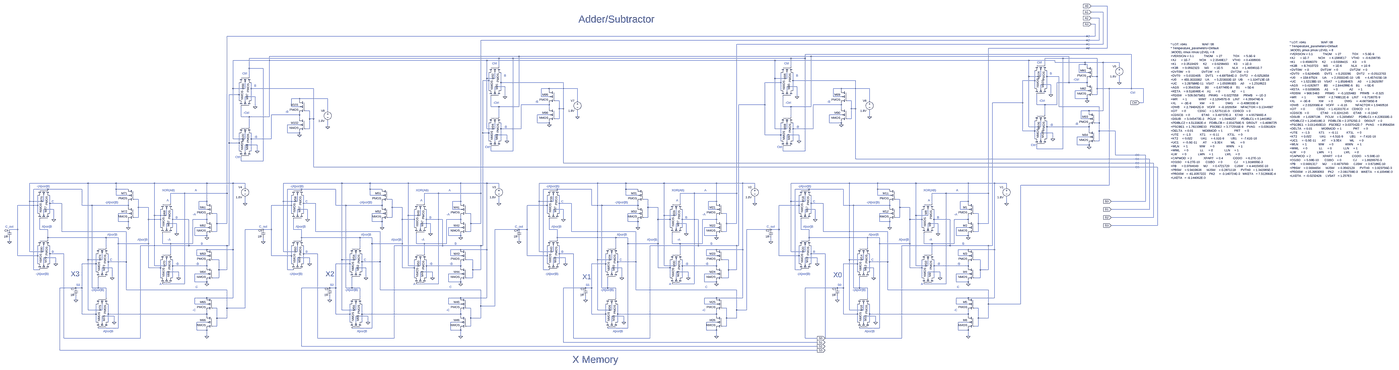
[diagram p0: schematic Adder_Subtractor.asc, whole sheet]
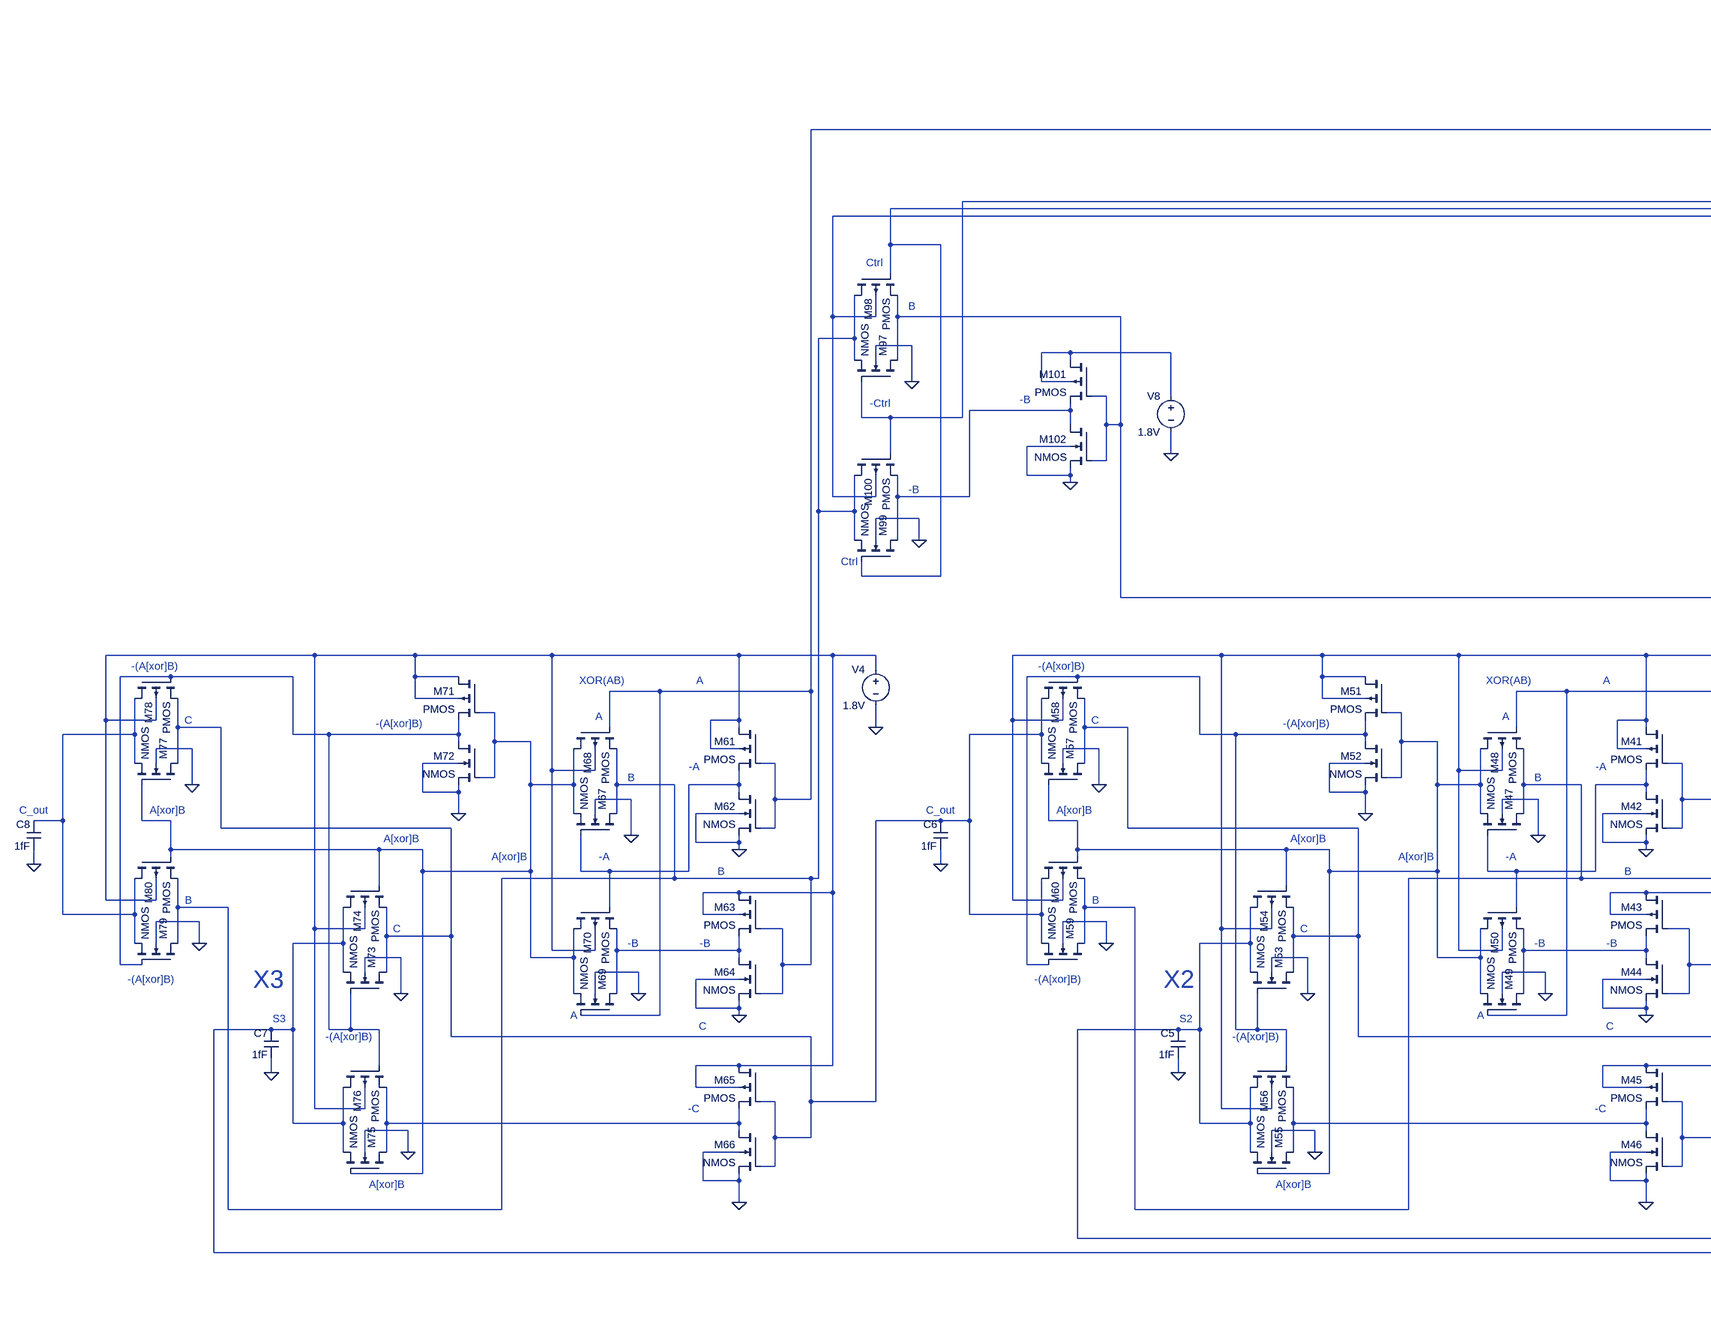
[diagram p1: schematic Adder_Subtractor.asc, part, row 1 of 1, column 1 of 3]
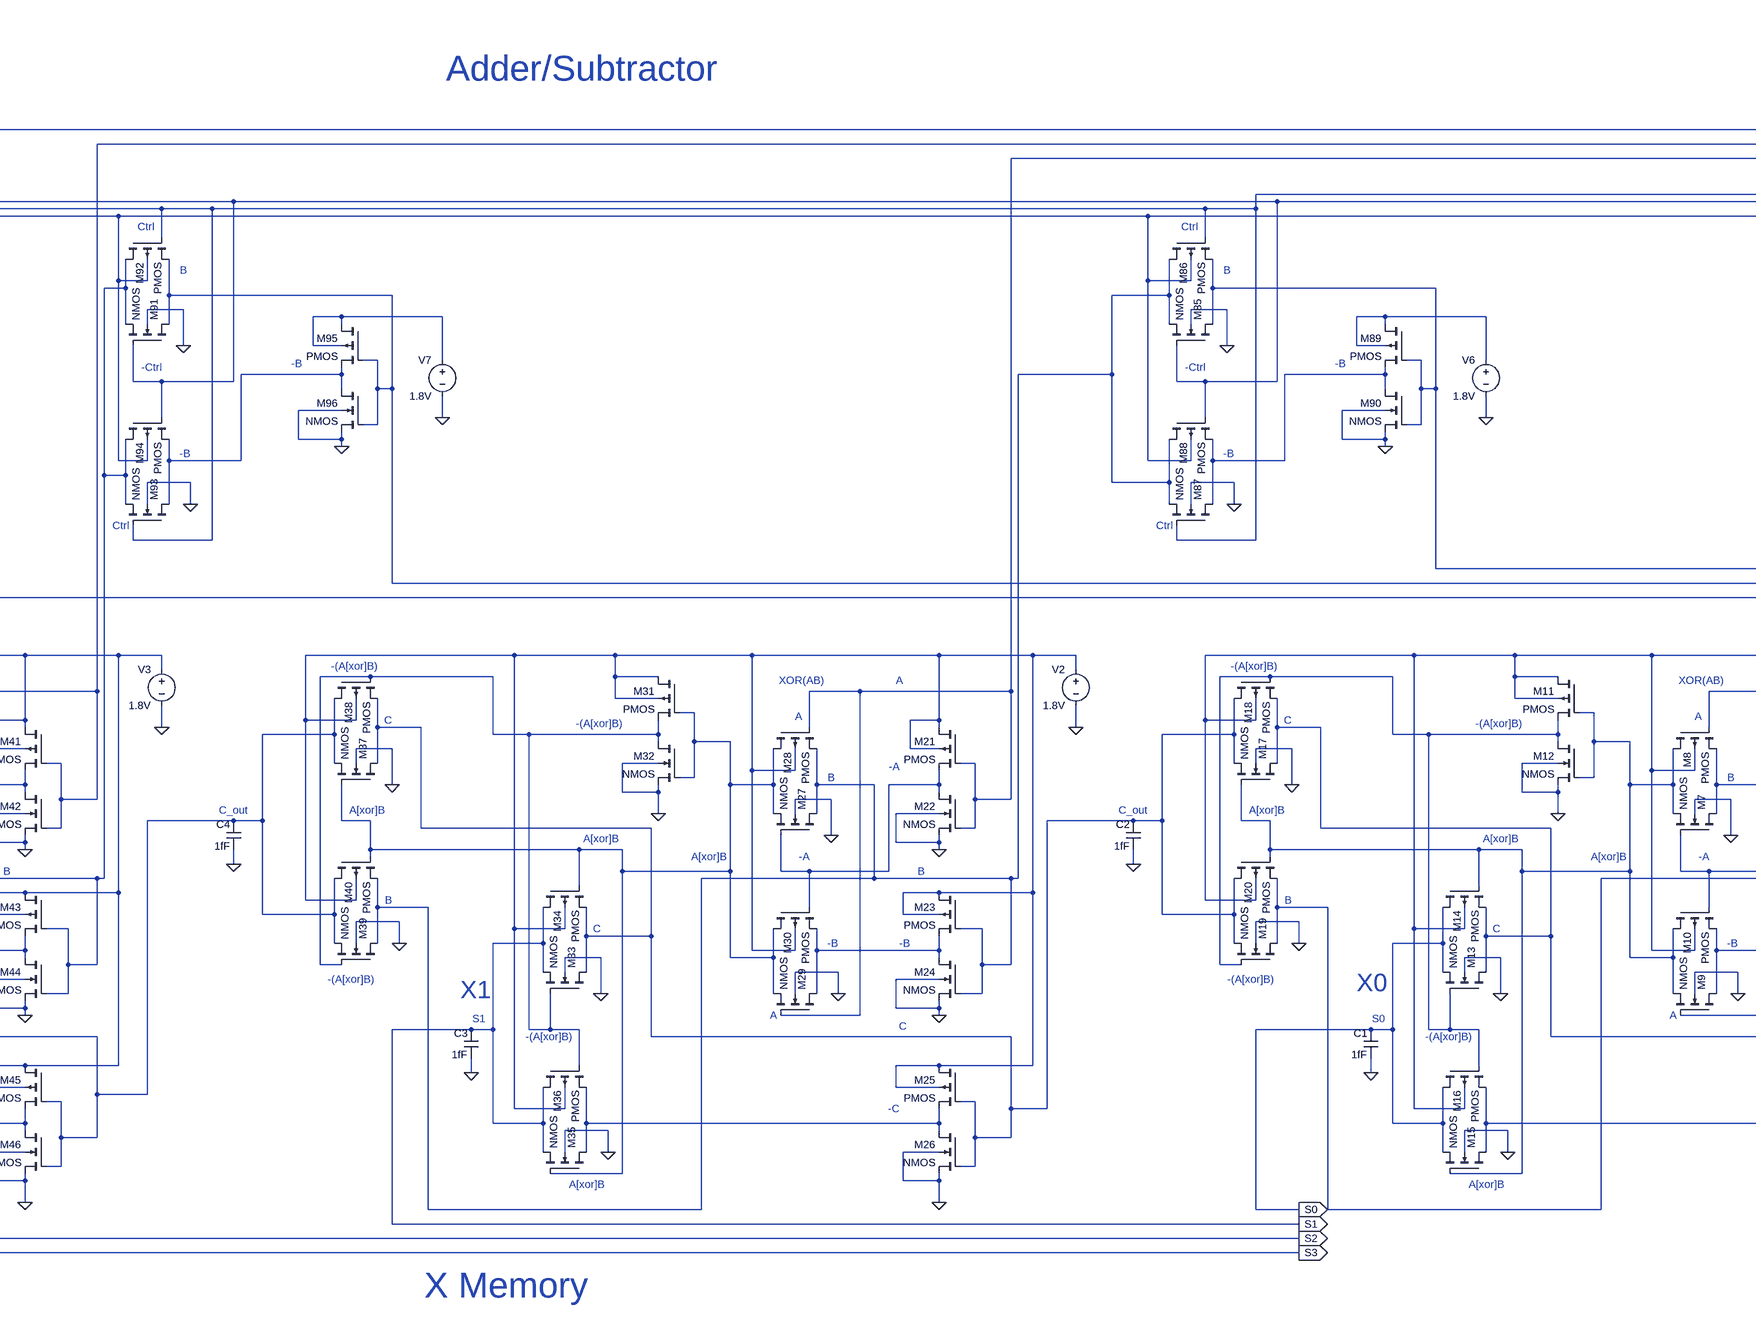
[diagram p2: schematic Adder_Subtractor.asc, part, row 1 of 1, column 2 of 3]
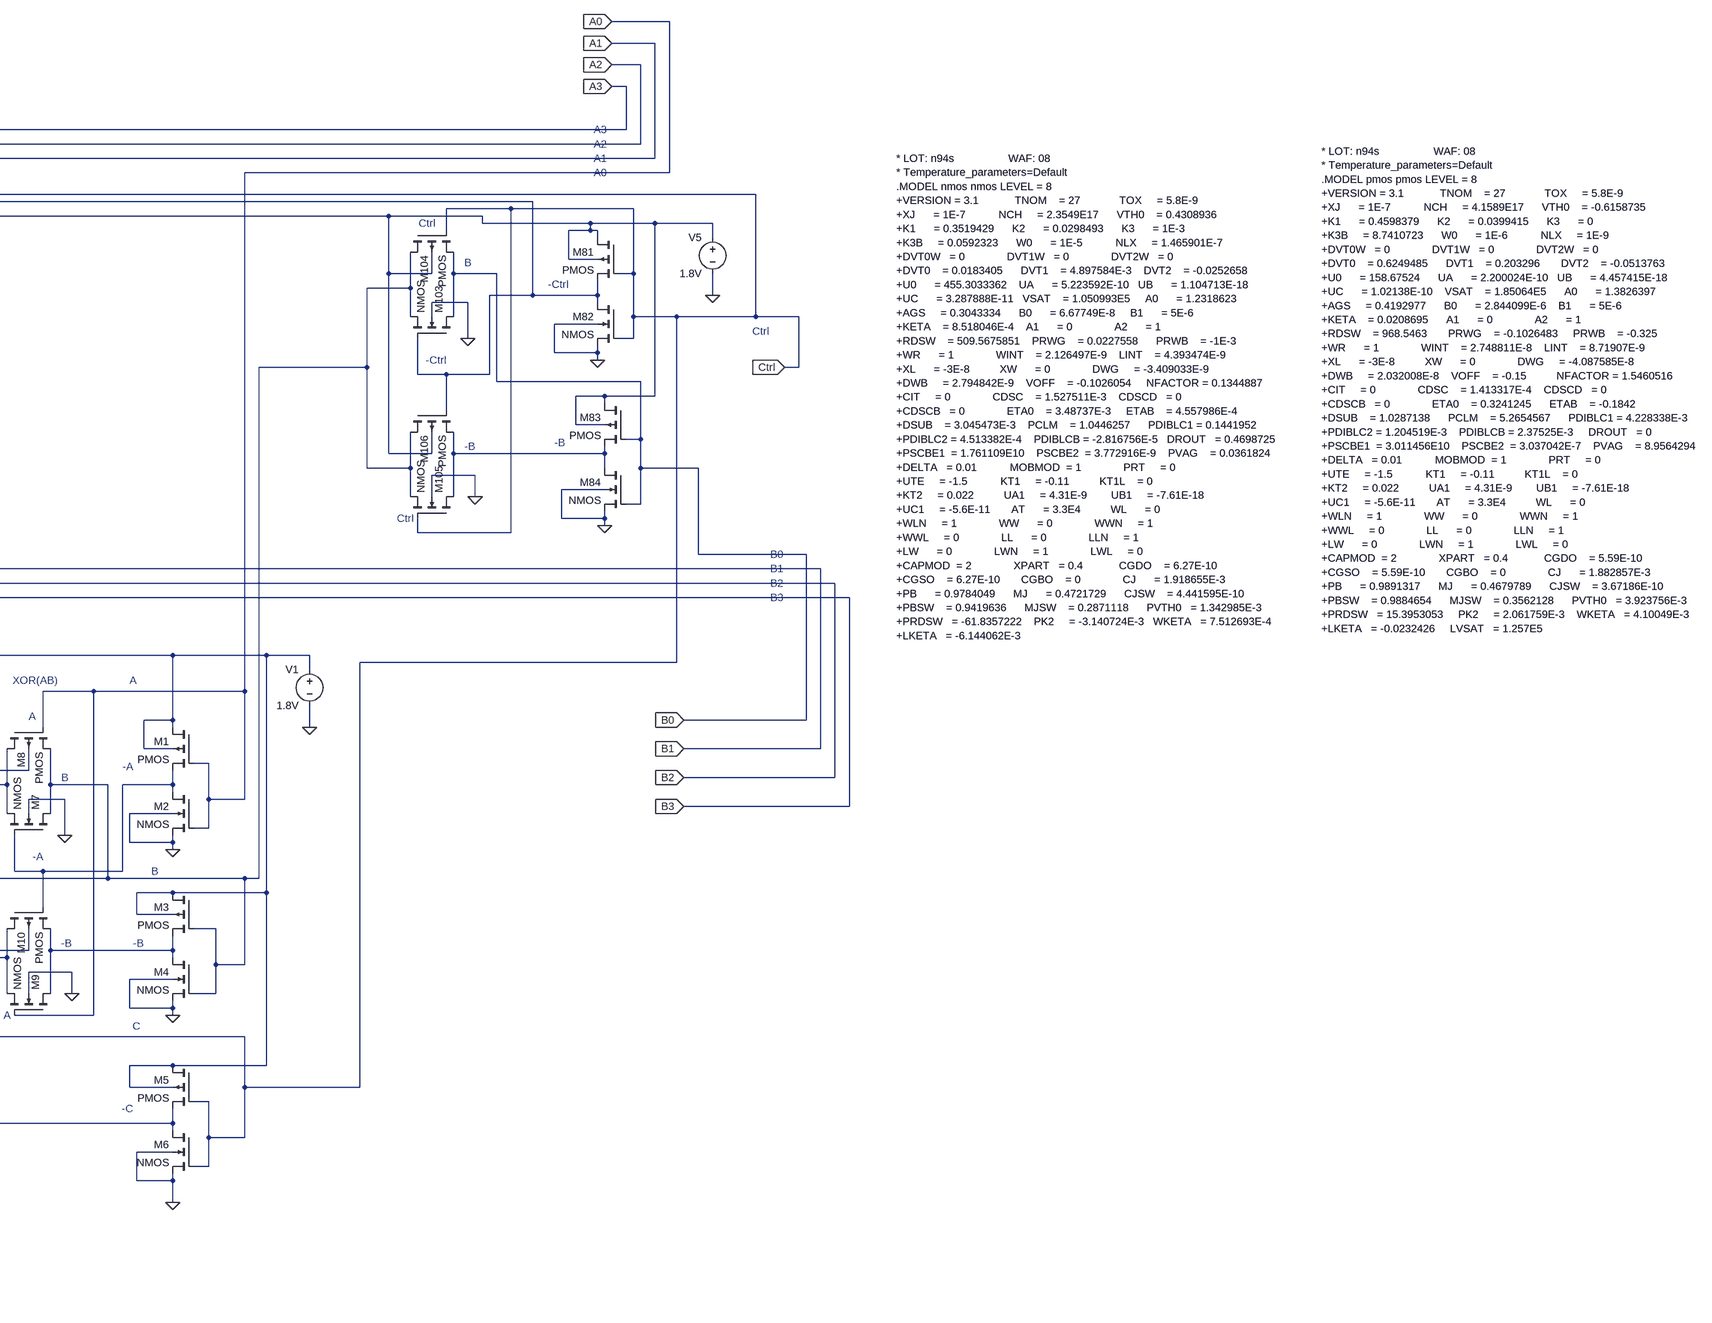
[diagram p3: schematic Adder_Subtractor.asc, part, row 1 of 1, column 3 of 3]
* Adder_Subtractor.asc
V1 N017 0 1.8V
M1 N017 A0 N033 N017 PMOS l=180n w=880n
M2 N033 A0 0 0 NMOS l=180n w=440n
M3 N017 N004 N037 N017 PMOS l=180n w=880n
M4 N037 N004 0 0 NMOS l=180n w=440n
M5 N017 Ctrl N041 N017 PMOS l=180n w=880n
M6 N041 Ctrl 0 0 NMOS l=180n w=440n
M7 N004 N033 N025 0 NMOS l=180n w=440n
M8 N025 A0 N004 N017 PMOS l=180n w=440n
M9 N037 A0 N025 0 NMOS l=180n w=440n
M10 N025 N033 N037 N017 PMOS l=180n w=440n
M11 N017 N025 N021 N017 PMOS l=180n w=880n
M12 N021 N025 0 0 NMOS l=180n w=440n
M13 Ctrl N021 S0 0 NMOS l=180n w=440n
M14 S0 N025 Ctrl N017 PMOS l=180n w=440n
M15 N041 N025 S0 0 NMOS l=180n w=440n
M16 S0 N021 N041 N017 PMOS l=180n w=440n
C1 S0 0 1fF
M17 Ctrl N025 N028 0 NMOS l=180n w=440n
M18 N028 N021 Ctrl N017 PMOS l=180n w=440n
M19 N004 N021 N028 0 NMOS l=180n w=440n
M20 N028 N025 N004 N017 PMOS l=180n w=440n
C2 N028 0 1fF
V2 N016 0 1.8V
M21 N016 A1 N032 N016 PMOS l=180n w=880n
M22 N032 A1 0 0 NMOS l=180n w=440n
M23 N016 N005 N036 N016 PMOS l=180n w=880n
M24 N036 N005 0 0 NMOS l=180n w=440n
M25 N016 N028 N040 N016 PMOS l=180n w=880n
M26 N040 N028 0 0 NMOS l=180n w=440n
M27 N005 N032 N024 0 NMOS l=180n w=440n
M28 N024 A1 N005 N016 PMOS l=180n w=440n
M29 N036 A1 N024 0 NMOS l=180n w=440n
M30 N024 N032 N036 N016 PMOS l=180n w=440n
M31 N016 N024 N020 N016 PMOS l=180n w=880n
M32 N020 N024 0 0 NMOS l=180n w=440n
M33 N028 N020 S1 0 NMOS l=180n w=440n
M34 S1 N024 N028 N016 PMOS l=180n w=440n
M35 N040 N024 S1 0 NMOS l=180n w=440n
M36 S1 N020 N040 N016 PMOS l=180n w=440n
C3 S1 0 1fF
M37 N028 N024 N027 0 NMOS l=180n w=440n
M38 N027 N020 N028 N016 PMOS l=180n w=440n
M39 N005 N020 N027 0 NMOS l=180n w=440n
M40 N027 N024 N005 N016 PMOS l=180n w=440n
C4 N027 0 1fF
V3 N015 0 1.8V
M41 N015 A2 N031 N015 PMOS l=180n w=880n
M42 N031 A2 0 0 NMOS l=180n w=440n
M43 N015 N003 N035 N015 PMOS l=180n w=880n
M44 N035 N003 0 0 NMOS l=180n w=440n
M45 N015 N027 N039 N015 PMOS l=180n w=880n
M46 N039 N027 0 0 NMOS l=180n w=440n
M47 N003 N031 N023 0 NMOS l=180n w=440n
M48 N023 A2 N003 N015 PMOS l=180n w=440n
M49 N035 A2 N023 0 NMOS l=180n w=440n
M50 N023 N031 N035 N015 PMOS l=180n w=440n
M51 N015 N023 N019 N015 PMOS l=180n w=880n
M52 N019 N023 0 0 NMOS l=180n w=440n
M53 N027 N019 S2 0 NMOS l=180n w=440n
M54 S2 N023 N027 N015 PMOS l=180n w=440n
M55 N039 N023 S2 0 NMOS l=180n w=440n
M56 S2 N019 N039 N015 PMOS l=180n w=440n
C5 S2 0 1fF
M57 N027 N023 N026 0 NMOS l=180n w=440n
M58 N026 N019 N027 N015 PMOS l=180n w=440n
M59 N003 N019 N026 0 NMOS l=180n w=440n
M60 N026 N023 N003 N015 PMOS l=180n w=440n
C6 N026 0 1fF
V4 N014 0 1.8V
M61 N014 A3 N030 N014 PMOS l=180n w=880n
M62 N030 A3 0 0 NMOS l=180n w=440n
M63 N014 N008 N034 N014 PMOS l=180n w=880n
M64 N034 N008 0 0 NMOS l=180n w=440n
M65 N014 N026 N038 N014 PMOS l=180n w=880n
M66 N038 N026 0 0 NMOS l=180n w=440n
M67 N008 N030 N022 0 NMOS l=180n w=440n
M68 N022 A3 N008 N014 PMOS l=180n w=440n
M69 N034 A3 N022 0 NMOS l=180n w=440n
M70 N022 N030 N034 N014 PMOS l=180n w=440n
M71 N014 N022 N018 N014 PMOS l=180n w=880n
M72 N018 N022 0 0 NMOS l=180n w=440n
M73 N026 N018 S3 0 NMOS l=180n w=440n
M74 S3 N022 N026 N014 PMOS l=180n w=440n
M75 N038 N022 S3 0 NMOS l=180n w=440n
M76 S3 N018 N038 N014 PMOS l=180n w=440n
C7 S3 0 1fF
M77 N026 N022 N029 0 NMOS l=180n w=440n
M78 N029 N018 N026 N014 PMOS l=180n w=440n
M79 N008 N018 N029 0 NMOS l=180n w=440n
M80 N029 N022 N008 N014 PMOS l=180n w=440n
C8 N029 0 1fF
M81 N002 Ctrl N001 N002 PMOS l=180n w=880n
M82 N001 Ctrl 0 0 NMOS l=180n w=440n
M83 N002 B0 N013 N002 PMOS l=180n w=880n
M84 N013 B0 0 0 NMOS l=180n w=440n
V5 N002 0 1.8V
M85 B1 N001 N005 0 NMOS l=180n w=440n
M86 N005 Ctrl B1 N002 PMOS l=180n w=440n
M87 N011 Ctrl N005 0 NMOS l=180n w=440n
M88 N005 N001 N011 N002 PMOS l=180n w=440n
M89 N007 B1 N011 N007 PMOS l=180n w=880n
M90 N011 B1 0 0 NMOS l=180n w=440n
V6 N007 0 1.8V
M91 B2 N001 N003 0 NMOS l=180n w=440n
M92 N003 Ctrl B2 N002 PMOS l=180n w=440n
M93 N010 Ctrl N003 0 NMOS l=180n w=440n
M94 N003 N001 N010 N002 PMOS l=180n w=440n
M95 N006 B2 N010 N006 PMOS l=180n w=880n
M96 N010 B2 0 0 NMOS l=180n w=440n
V7 N006 0 1.8V
M97 B3 N001 N008 0 NMOS l=180n w=440n
M98 N008 Ctrl B3 N002 PMOS l=180n w=440n
M99 N012 Ctrl N008 0 NMOS l=180n w=440n
M100 N008 N001 N012 N002 PMOS l=180n w=440n
M101 N009 B3 N012 N009 PMOS l=180n w=880n
M102 N012 B3 0 0 NMOS l=180n w=440n
V8 N009 0 1.8V
M103 B0 N001 N004 0 NMOS l=180n w=440n
M104 N004 Ctrl B0 N002 PMOS l=180n w=440n
M105 N013 Ctrl N004 0 NMOS l=180n w=440n
M106 N004 N001 N013 N002 PMOS l=180n w=440n
.model NMOS NMOS
.model PMOS PMOS
.lib standard.mos
* -A
* -B
* -C
* A
* B
* C
* B
* -A
* A
* -B
* A
* A[xor]B
* -(A[xor]B)
* -(A[xor]B)
* A[xor]B
* A[xor]B
* C
* S0
* C
* -(A[xor]B)
* -(A[xor]B)
* A[xor]B
* B
* C_out
* XOR(AB)
* -A
* -B
* -C
* A
* B
* C
* B
* -A
* A
* -B
* A
* A[xor]B
* -(A[xor]B)
* -(A[xor]B)
* A[xor]B
* A[xor]B
* C
* S1
* C
* -(A[xor]B)
* -(A[xor]B)
* A[xor]B
* B
* C_out
* XOR(AB)
* -A
* -B
* -C
* A
* B
* C
* B
* -A
* A
* -B
* A
* A[xor]B
* -(A[xor]B)
* -(A[xor]B)
* A[xor]B
* A[xor]B
* C
* S2
* C
* -(A[xor]B)
* -(A[xor]B)
* A[xor]B
* B
* C_out
* XOR(AB)
* -A
* -B
* -C
* A
* B
* C
* B
* -A
* A
* -B
* A
* A[xor]B
* -(A[xor]B)
* -(A[xor]B)
* A[xor]B
* A[xor]B
* C
* S3
* C
* -(A[xor]B)
* -(A[xor]B)
* A[xor]B
* B
* C_out
* XOR(AB)
* -Ctrl
* -B
* Ctrl
* B0
* A0
* B
* -Ctrl
* Ctrl
* -B
* Ctrl
* -B
* B1
* A1
* B
* -Ctrl
* Ctrl
* -B
* Ctrl
* -B
* B2
* A2
* B
* -Ctrl
* Ctrl
* -B
* Ctrl
* -B
* A3
* B3
* B
* -Ctrl
* -B
* Ctrl
* Ctrl
* Adder/Subtractor
* X Memory
* X0
* X1
* X2
* X3
* LOT: n94s                  WAF: 08
* Temperature_parameters=Default
.MODEL nmos nmos LEVEL = 8
+VERSION = 3.1            TNOM    = 27             TOX     = 5.8E-9
+XJ      = 1E-7           NCH     = 2.3549E17      VTH0    = 0.4308936
+K1      = 0.3519429      K2      = 0.0298493      K3      = 1E-3
+K3B     = 0.0592323      W0      = 1E-5           NLX     = 1.465901E-7
+DVT0W   = 0              DVT1W   = 0              DVT2W   = 0
+DVT0    = 0.0183405      DVT1    = 4.897584E-3    DVT2    = -0.0252658
+U0      = 455.3033362    UA      = 5.223592E-10   UB      = 1.104713E-18
+UC      = 3.287888E-11   VSAT    = 1.050993E5     A0      = 1.2318623
+AGS     = 0.3043334      B0      = 6.67749E-8     B1      = 5E-6
+KETA    = 8.518046E-4    A1      = 0              A2      = 1
+RDSW    = 509.5675851    PRWG    = 0.0227558      PRWB    = -1E-3
+WR      = 1              WINT    = 2.126497E-9    LINT    = 4.393474E-9
+XL      = -3E-8          XW      = 0              DWG     = -3.409033E-9
+DWB     = 2.794842E-9    VOFF    = -0.1026054     NFACTOR = 0.1344887
+CIT     = 0              CDSC    = 1.527511E-3    CDSCD   = 0
+CDSCB   = 0              ETA0    = 3.48737E-3     ETAB    = 4.557986E-4
+DSUB    = 3.045473E-3    PCLM    = 1.0446257      PDIBLC1 = 0.1441952
+PDIBLC2 = 4.513382E-4    PDIBLCB = -2.816756E-5   DROUT   = 0.4698725
+PSCBE1  = 1.761109E10    PSCBE2  = 3.772916E-9    PVAG    = 0.0361824
+DELTA   = 0.01           MOBMOD  = 1              PRT     = 0
+UTE     = -1.5           KT1     = -0.11          KT1L    = 0
+KT2     = 0.022          UA1     = 4.31E-9        UB1     = -7.61E-18
+UC1     = -5.6E-11       AT      = 3.3E4          WL      = 0
+WLN     = 1              WW      = 0              WWN     = 1
+WWL     = 0              LL      = 0              LLN     = 1
+LW      = 0              LWN     = 1              LWL     = 0
+CAPMOD  = 2              XPART   = 0.4            CGDO    = 6.27E-10
+CGSO    = 6.27E-10       CGBO    = 0              CJ      = 1.918655E-3
+PB      = 0.9784049      MJ      = 0.4721729      CJSW    = 4.441595E-10
+PBSW    = 0.9419636      MJSW    = 0.2871118      PVTH0   = 1.342985E-3
+PRDSW   = -61.8357222    PK2     = -3.140724E-3   WKETA   = 7.512693E-4
+LKETA   = -6.144062E-3
* LOT: n94s                  WAF: 08
* Temperature_parameters=Default
.MODEL pmos pmos LEVEL = 8
+VERSION = 3.1            TNOM    = 27             TOX     = 5.8E-9
+XJ      = 1E-7           NCH     = 4.1589E17      VTH0    = -0.6158735
+K1      = 0.4598379      K2      = 0.0399415      K3      = 0
+K3B     = 8.7410723      W0      = 1E-6           NLX     = 1E-9
+DVT0W   = 0              DVT1W   = 0              DVT2W   = 0
+DVT0    = 0.6249485      DVT1    = 0.203296       DVT2    = -0.0513763
+U0      = 158.67524      UA      = 2.200024E-10   UB      = 4.457415E-18
+UC      = 1.02138E-10    VSAT    = 1.85064E5      A0      = 1.3826397
+AGS     = 0.4192977      B0      = 2.844099E-6    B1      = 5E-6
+KETA    = 0.0208695      A1      = 0              A2      = 1
+RDSW    = 968.5463       PRWG    = -0.1026483     PRWB    = -0.325
+WR      = 1              WINT    = 2.748811E-8    LINT    = 8.71907E-9
+XL      = -3E-8          XW      = 0              DWG     = -4.087585E-8
+DWB     = 2.032008E-8    VOFF    = -0.15          NFACTOR = 1.5460516
+CIT     = 0              CDSC    = 1.413317E-4    CDSCD   = 0
+CDSCB   = 0              ETA0    = 0.3241245      ETAB    = -0.1842
+DSUB    = 1.0287138      PCLM    = 5.2654567      PDIBLC1 = 4.228338E-3
+PDIBLC2 = 1.204519E-3    PDIBLCB = 2.37525E-3     DROUT   = 0
+PSCBE1  = 3.011456E10    PSCBE2  = 3.037042E-7    PVAG    = 8.9564294
+DELTA   = 0.01           MOBMOD  = 1              PRT     = 0
+UTE     = -1.5           KT1     = -0.11          KT1L    = 0
+KT2     = 0.022          UA1     = 4.31E-9        UB1     = -7.61E-18
+UC1     = -5.6E-11       AT      = 3.3E4          WL      = 0
+WLN     = 1              WW      = 0              WWN     = 1
+WWL     = 0              LL      = 0              LLN     = 1
+LW      = 0              LWN     = 1              LWL     = 0
+CAPMOD  = 2              XPART   = 0.4            CGDO    = 5.59E-10
+CGSO    = 5.59E-10       CGBO    = 0              CJ      = 1.882857E-3
+PB      = 0.9891317      MJ      = 0.4679789      CJSW    = 3.67186E-10
+PBSW    = 0.9884654      MJSW    = 0.3562128      PVTH0   = 3.923756E-3
+PRDSW   = 15.3953053     PK2     = 2.061759E-3    WKETA   = 4.10049E-3
+LKETA   = -0.0232426     LVSAT   = 1.257E5
.backanno
.end